# Altium schematic sheet Expantion connectors.SchDoc
size A4
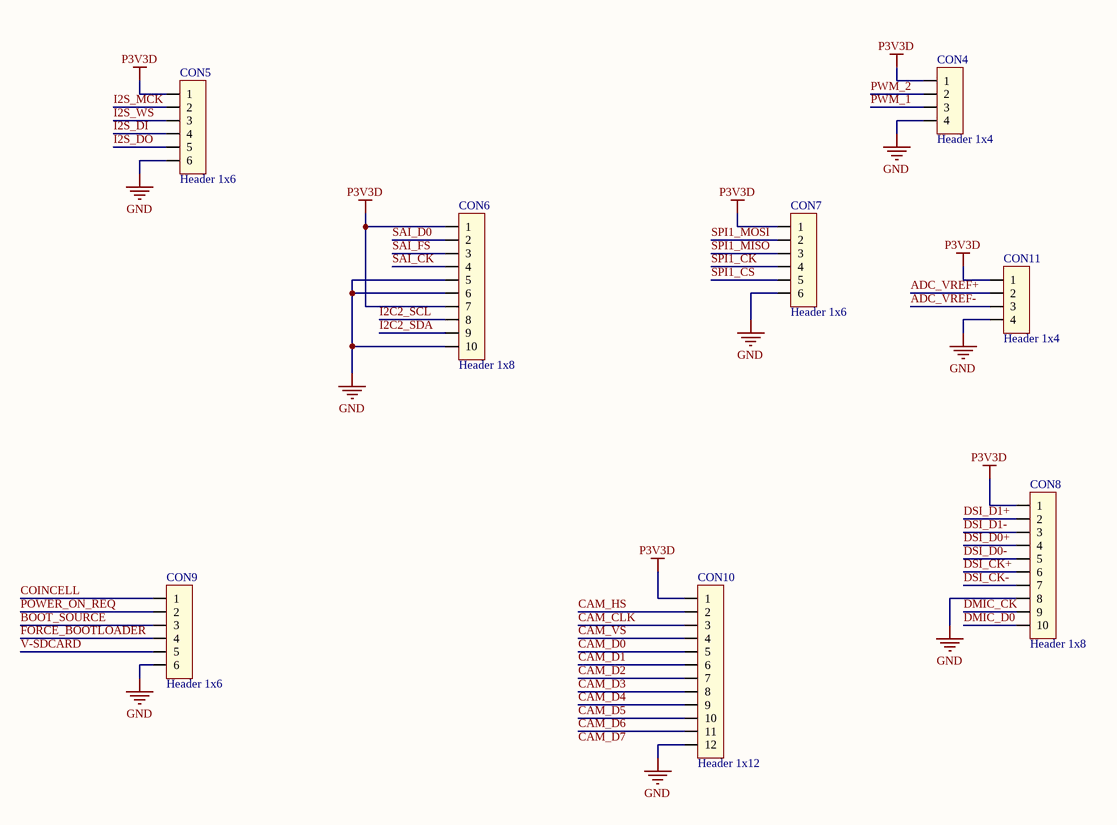
[diagram p0: Expantion connectors.SchDoc]

## Parts
CON4  Header 1x4  [61300411121]
CON5  Header 1x6  [61300611121]
CON6  Header 1x8  [61301011121]
CON7  Header 1x6  [61300611121]
CON8  Header 1x8  [61301011121]
CON9  Header 1x6  [61300611121]
CON10  Header 1x12  [61301211121]
CON11  Header 1x4  [61300411121]

## Nets
GND: CON4.4 CON5.6 CON6.5 CON6.6 CON6.10 CON7.6 CON8.8 CON9.6 CON10.12 CON11.4
P3V3D: CON4.1 CON5.1 CON6.1 CON6.7 CON7.1 CON8.1 CON10.1 CON11.1
ADC_VREF+: CON11.2
ADC_VREF-: CON11.3
BOOT_SOURCE: CON9.3
CAM_CLK: CON10.3
CAM_D0: CON10.5
CAM_D1: CON10.6
CAM_D2: CON10.7
CAM_D3: CON10.8
CAM_D4: CON10.9
CAM_D5: CON10.10
CAM_D6: CON10.11
CAM_HS: CON10.2
CAM_VS: CON10.4
COINCELL: CON9.1
DMIC_CK: CON8.9
DMIC_D0: CON8.10
DSI_CK+: CON8.6
DSI_CK-: CON8.7
DSI_D0+: CON8.4
DSI_D0-: CON8.5
DSI_D1+: CON8.2
DSI_D1-: CON8.3
FORCE_BOOTLOADER: CON9.4
I2C2_SCL: CON6.8
I2C2_SDA: CON6.9
I2S_DI: CON5.4
I2S_DO: CON5.5
I2S_MCK: CON5.2
I2S_WS: CON5.3
POWER_ON_REQ: CON9.2
PWM_1: CON4.3
PWM_2: CON4.2
SAI_CK: CON6.4
SAI_D0: CON6.2
SAI_FS: CON6.3
SPI1_CK: CON7.4
SPI1_CS: CON7.5
SPI1_MISO: CON7.3
SPI1_MOSI: CON7.2
V-SDCARD: CON9.5

## Notes on the sheet
- Labels drawn without touching a wire or pin: CAM_D7
- Title:
- Size:
- Date:
- A4
- Author:
- Revision:
- Sheet
- of
- DME-Projects
- Mannestraat 77
- 2440 Geel
- info@dme-projects.be
- Project:
- © DME-projects 2020

## Library data of the parts
CON4 CON11 = CMP-00034-2: Wurth elektronik 61300411121; Connector Type: Male Pin; Number of Positions: 4; Gender: Male; Pitch: 0.1inch; Termination: Solder; Packaging: Bulk; Lead Free: Lead Free; REACH SVHC: Unknown; Color: Black; Mount: Through Hole; Contact Plating: Gold; Contact Material: Copper; Number of Contacts: 4; Contact Mating Length: 0.236inch; Number of Rows: 1
CON5 CON7 CON9 = CMP-002-00282-1: WURTH ELEKTRONIK - 61300611121 - Pin Header, Board-to-Board, 2.54 mm, 1 Rows, 6 Contacts, Through Hole, WR-PHD Series; Voltage Rating: 250V; Current Rating: 3A; Number of Positions: 6; Pitch: 0.1inch; Connector Type: Male Pin; Gender: Male; Contact Mating Length: 0.236inch; Packaging: Bulk; Number of Rows: 1; Max Operating Temperature: 125°C; Termination: Through Hole; Mount: Through Hole; Contact Plating: Gold; Color: Black; Housing Material: PBT; Contact Gender: Male; Lead Free: Lead Free; Contact Material: Copper Alloy,Copper; Min Operating Temperature: -40°C; REACH SVHC: Unknown; Number of Contacts: 6
CON6 CON8 = CMP-00035-3: WURTH ELEKTRONIK - 61301011121 - Pin Header, Board-to-Board, 2.54 mm, 1 Rows, 10 Contacts, Through Hole, WR-PHD Series; Number of Positions: 10; Gender: Male; Connector Type: Male Pin; Voltage Rating: 250V; Pitch: 2.54mm; Insulation Resistance: 1GR; Current Rating: 3A; Packaging: Bulk; Contact Plating: Gold; Contact Gender: Male; Number of Rows: 1; Package Quantity: 1000; Flammability Rating: UL94 V-0; Contact Mating Length: 0.236inch; Contact Type: Male Pin; Housing Material: PBT; Contact Material: Copper Alloy,Copper; Min Operating Temperature: -40°C; Height: 11.54mm; Termination: Solder; Max Operating Temperature: 125°C; Color: Black; Orientation: Straight; Length: 2.54mm; REACH SVHC: Unknown; Series: WR-PHD; Width: 25.4mm; Number of Contacts: 10; Mount: Through Hole
CON10 = CMP-002-00283-1: Header 1x12 2.54mm